# EAGLE design Si5351 (EAGLE 9.3.1)
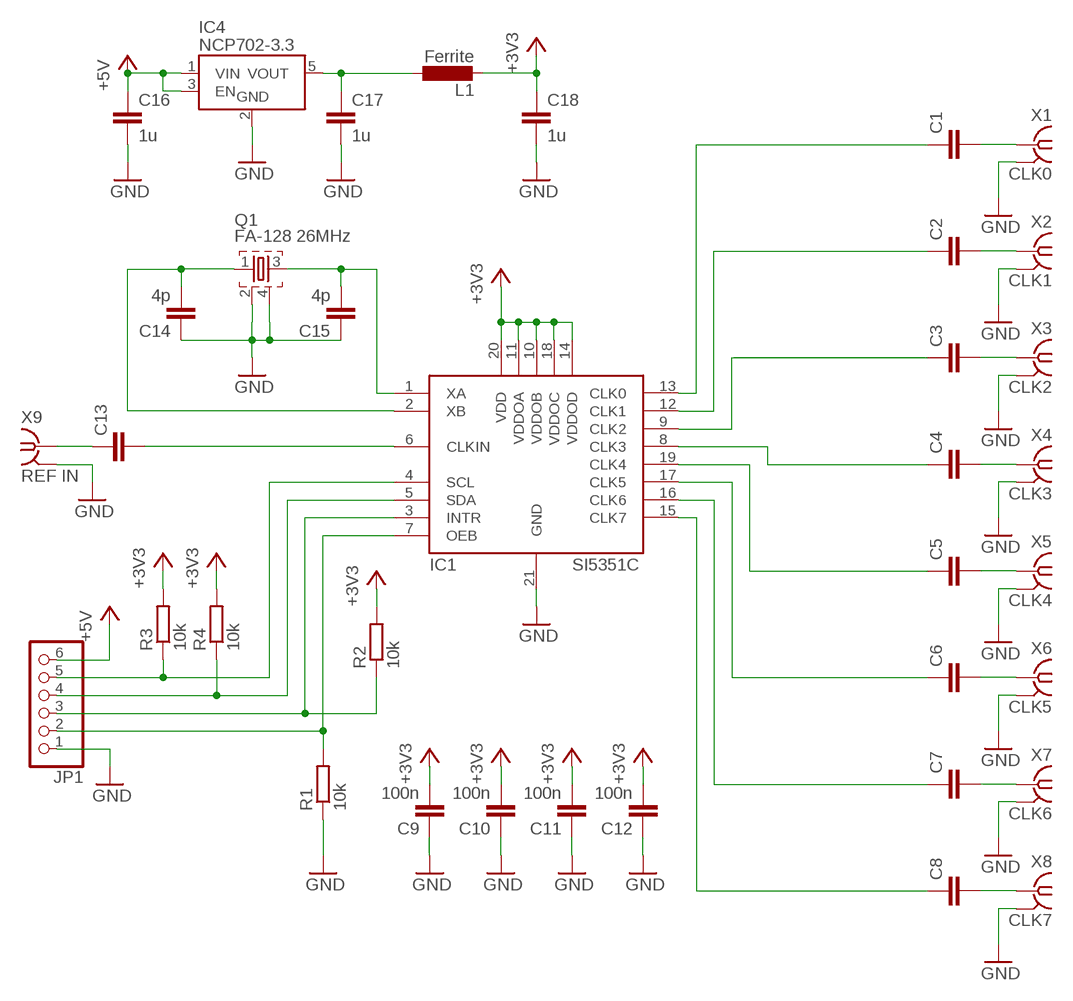
[diagram p0: schematic, sheet 1]

## Parts
C1  C-EUC0603  [C0603]
C2  C-EUC0603  [C0603]
C3  C-EUC0603  [C0603]
C4  C-EUC0603  [C0603]
C5  C-EUC0603  [C0603]
C6  C-EUC0603  [C0603]
C7  C-EUC0603  [C0603]
C8  C-EUC0603  [C0603]
C9  100n  C-EUC0603  [C0603]
C10  100n  C-EUC0603  [C0603]
C11  100n  C-EUC0603  [C0603]
C12  100n  C-EUC0603  [C0603]
C13  C-EUC0603  [C0603]
C14  4p  C-EUC0603  [C0603]
C15  4p  C-EUC0603  [C0603]
C16  1u  C-EUC0603  [C0603]
C17  1u  C-EUC0603  [C0603]
C18  1u  C-EUC0603  [C0603]
IC1  SI5351C  [QFN50P400X400X90-21T270N]
IC4  NCP702-3.3  NCP702  [SOT95P240X110-5]
JP1  PINHD-1X6/90  [1X06/90]
L1  Ferrite  INDUCTOR0603  [R0603]
Q1  FA-128 26MHz  FA-128  [FA-128]
R1  10k  R-EU_R0603  [R0603]
R2  10k  R-EU_R0603  [R0603]
R3  10k  R-EU_R0603  [R0603]
R4  10k  R-EU_R0603  [R0603]
X1  CLK0  SMA_CONNECTOR  [J502-ND-142-0711-821/826]
X2  CLK1  SMA_CONNECTOR  [J502-ND-142-0711-821/826]
X3  CLK2  SMA_CONNECTOR  [J502-ND-142-0711-821/826]
X4  CLK3  SMA_CONNECTOR  [J502-ND-142-0711-821/826]
X5  CLK4  SMA_CONNECTOR  [J502-ND-142-0711-821/826]
X6  CLK5  SMA_CONNECTOR  [J502-ND-142-0711-821/826]
X7  CLK6  SMA_CONNECTOR  [J502-ND-142-0711-821/826]
X8  CLK7  SMA_CONNECTOR  [J502-ND-142-0711-821/826]
X9  REF IN  SMA_CONNECTOR  [J502-ND-142-0711-821/826]

## Nets
+3V3: C9.2 C10.2 C11.2 C12.2 C18.1 IC1.10(VDDOB) IC1.11(VDDOA) IC1.14(VDDOD) IC1.18(VDDOC) IC1.20(VDD) L1.2 R2.2 R3.2 R4.2
+5V: C16.1 IC4.1(VIN) IC4.3(EN) JP1.6
GND: C9.1 C10.1 C11.1 C12.1 C14.1 C15.1 C16.2 C17.2 C18.2 IC1.21(GND) IC4.2(GND) JP1.1 Q1.2 Q1.4 R1.1 X1.G@1 X1.G@2 X1.G@3 X1.G@4 X2.G@1 X2.G@2 X2.G@3 X2.G@4 X3.G@1 X3.G@2 X3.G@3 X3.G@4 X4.G@1 X4.G@2 X4.G@3 X4.G@4 X5.G@1 X5.G@2 X5.G@3 X5.G@4 X6.G@1 X6.G@2 X6.G@3 X6.G@4 X7.G@1 X7.G@2 X7.G@3 X7.G@4 X8.G@1 X8.G@2 X8.G@3 X8.G@4 X9.G@1 X9.G@2 X9.G@3 X9.G@4
N$1: C1.2 X1.1
N$2: C2.2 X2.1
N$3: C3.2 X3.1
N$4: C4.2 X4.1
N$5: C5.2 X5.1
N$6: C6.2 X6.1
N$7: C7.2 X7.1
N$8: C8.2 X8.1
N$9: C1.1 IC1.13(CLK0)
N$10: C2.1 IC1.12(CLK1)
N$11: C3.1 IC1.9(CLK2)
N$12: C8.1 IC1.15(CLK7)
N$13: C7.1 IC1.16(CLK6)
N$14: C6.1 IC1.17(CLK5)
N$15: C5.1 IC1.19(CLK4)
N$16: C4.1 IC1.8(CLK3)
N$17: IC1.4(SCL) JP1.5 R3.1
N$18: C13.1 X9.1
N$19: C13.2 IC1.6(CLKIN)
N$20: IC1.5(SDA) JP1.4 R4.1
N$21: IC1.3(INTR) JP1.3 R2.1
N$22: IC1.7(OEB) JP1.2 R1.2
N$23: C15.2 IC1.1(XA) Q1.3
N$24: C14.2 IC1.2(XB) Q1.1
N$26: C17.1 IC4.5(VOUT) L1.1

## Library data of the parts
C1-C18 = rcl:C-EU: CAPACITOR, European symbol
IC1 = rf:SI5351C
IC4 = rf:NCP702
JP1 = pinhead:PINHD-1X6: PIN HEADER
L1 = rf:INDUCTOR
Q1 = crystal:FA-: MHz RANGE CRYSTAL UNIT Source: Epson Toyocom
R1-R4 = rcl:R-EU_: RESISTOR, European symbol
X1-X9 = rf:SMA_CONNECTOR

## Board
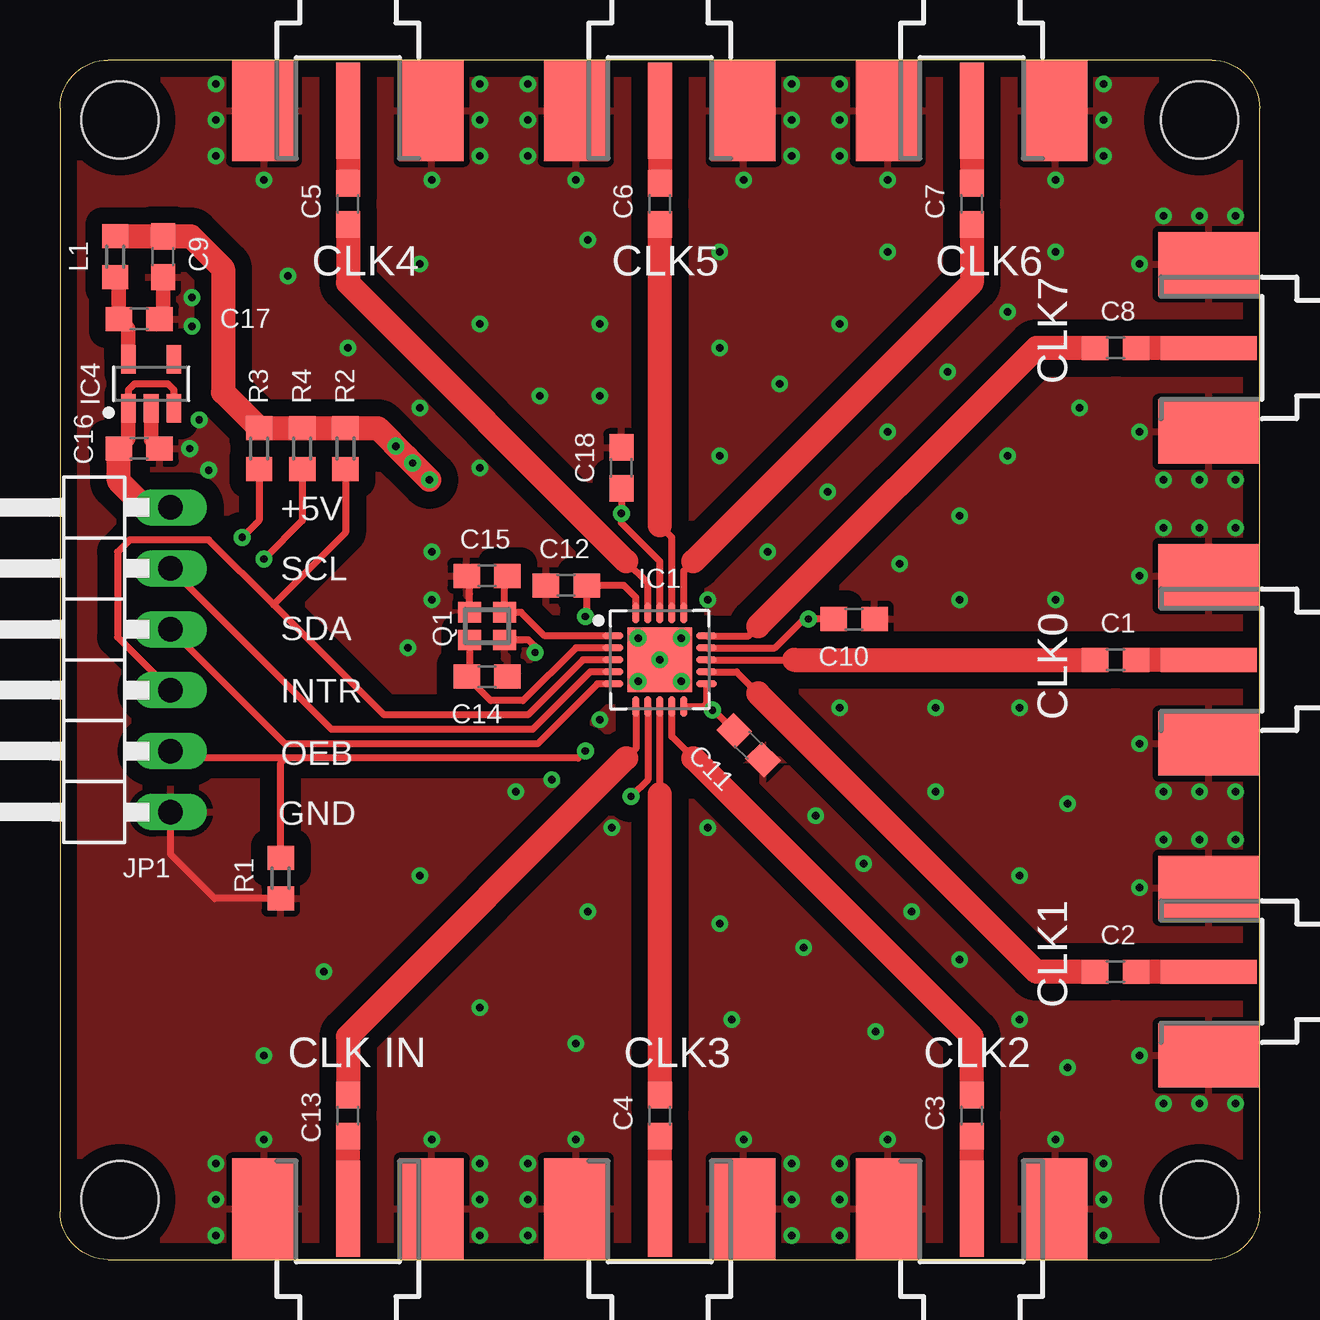
[diagram p1: board, top side]
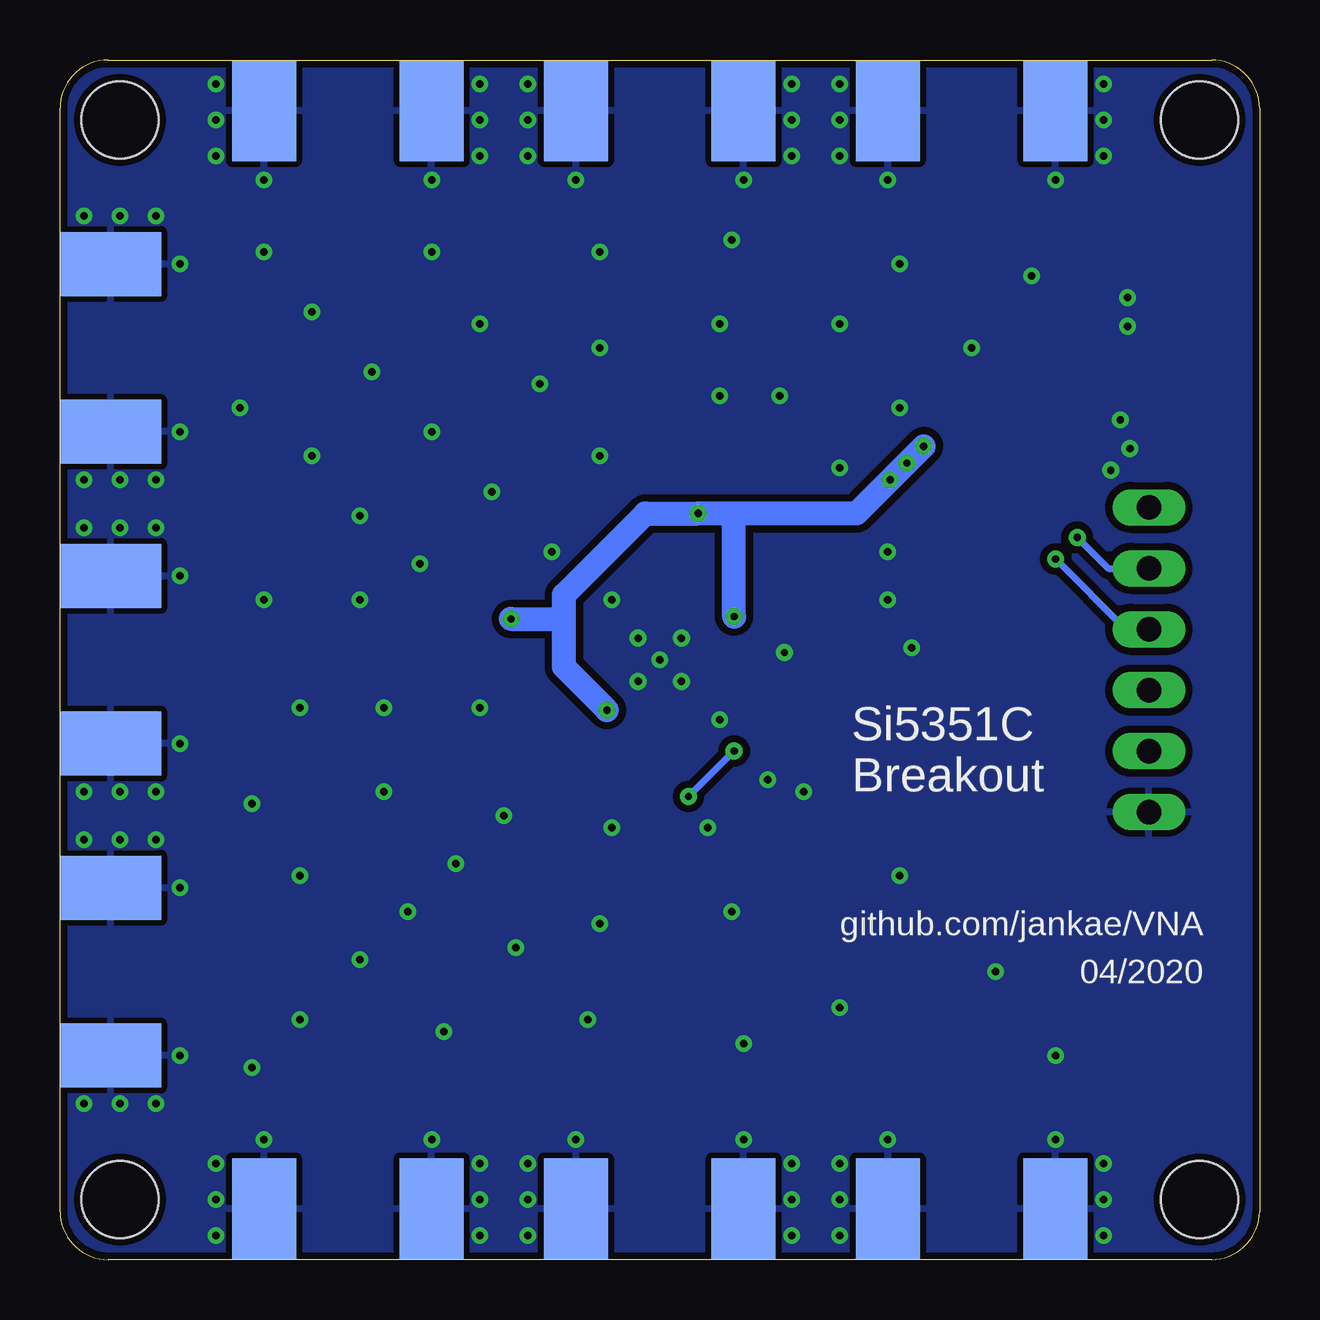
[diagram p2: board, bottom side, seen from below]

Size 50 x 50 mm. Coordinates in mm from the lower left corner, seen from the top.
Outline: 0,48 0,2 arc90 2,0 48,0 arc90 50,2 50,48 arc90 48,50 2,50 arc90 0,48
Copper layers (1*16): Top 0.035mm / dielectric 0.2mm / Bottom 0.035mm
Design rules "JLCPCB4L_7628 *": minimum track width 6mil, minimum drill 0.3mm, track to track 5mil, track to pad 5mil, pad to pad 5mil, via to via 5mil, smd to smd 0mil, copper to edge 0.2mm, drill to drill 0.2mm, minimum pad ring 10mil, minimum via ring 8mil, stop-mask expansion 4mil, vias tented up to drill 0mil, thermal gap 10mil
Holes 3.2 mm at 2.5,47.5 47.5,47.5 47.5,2.5 2.5,2.5

### Footprints (pad centres in the part's own frame; a part is rotated, then mirrored left to right if it is on the bottom)
C0603 = smd 1.1 x 1: 1 -0.85,0; 2 0.85,0
QFN50P400X400X90-21T270N = smd 0.838 x 0.27: 1 -1.946,1; 2 -1.946,0.5; 3 -1.946,0; 4 -1.946,-0.5; 5 -1.946,-1; 11 1.946,-1; 12 1.946,-0.5; 13 1.946,0; 14 1.946,0.5; 15 1.946,1 | smd 0.27 x 0.838: 6 -1,-1.946; 7 -0.5,-1.946; 8 0,-1.946; 9 0.5,-1.946; 10 1,-1.946; 16 1,1.946; 17 0.5,1.946; 18 0,1.946; 19 -0.5,1.946; 20 -1,1.946 | smd 2.7 x 2.7: 21 0,0
SOT95P240X110-5 = smd 1.18 x 0.609: 1 -1.024,0.95; 2 -1.024,0; 3 -1.024,-0.95; 4 1.024,-0.95; 5 1.024,0.95
1X06/90 = drill 1.016 long: 1 -6.35,-3.81; 2 -3.81,-3.81; 3 -1.27,-3.81; 4 1.27,-3.81; 5 3.81,-3.81; 6 6.35,-3.81
R0603 = smd 1 x 1.1: 1 -0.85,0; 2 0.85,0
FA-128 = smd 0.95 x 0.85: 1 -0.725,-0.575; 2 0.725,-0.575; 3 0.725,0.575; 4 -0.725,0.575
J502-ND-142-0711-821/826 = smd 4 x 1: 1 2.115,0 | smd 4.191 x 2.667: G@1 2.115,3.495; G@2 2.115,-3.495 | smd 4.191 x 2.667 bottom: G@3 2.115,3.495; G@4 2.115,-3.495

### Placement (x,y rotation side)
C1  44,25 0 top
C2  44,12 0 top
C3  38,6 270 top
C4  25,6 270 top
C5  12,44 90 top
C6  25,44 90 top
C7  38,44 90 top
C8  44,38 0 top
C9  4.3,41.8 90 top
C10  33.1,26.7 180 top
C11  28.7,21.44 135 top
C12  21.1,28.1 0 top
C13  12,6 90 top
C14  17.8,24.3 180 top
C15  17.8,28.5 0 top
C16  3.3,33.8 0 top
C17  3.3,39.2 0 top
C18  23.4,33 90 top
IC1  25,25 0 top
IC4  3.8,36.5 90 top
JP1  0.8,25 90 top
L1  2.3,41.8 90 top
Q1  17.8,26.4 0 top
R1  9.2,15.9 90 top
R2  11.9,33.8 90 top
R3  8.3,33.8 90 top
R4  10.1,33.8 90 top
X1  50,25 180 top
X2  50,12 180 top
X3  38,0 90 top
X4  25,0 90 top
X5  12,50 270 top
X6  25,50 270 top
X7  38,50 270 top
X8  50,38 180 top
X9  12,0 90 top

### Tracks (layer width: path | path; a pad name or v marks a point on that pad's centre or on a via)
+3V3  (via drill 0.3)
  Top 0.3: IC1.14 29.8,25.5 31,26.7 v31.2,26.7 C10.2 | C11.2 27.24,22.9 | 27.24,22.9 v27.2,22.9 | IC1.11 26.95,23.2 27.24,22.9 | IC1.10 27.09,23.05 27.24,22.9 | IC1.18 25,29.1 23.4,30.7 v23.4,31.1 C18.1 | IC1.20 24,27.6 23.5,28.1 C12.2 21.95,26.85 v21.9,26.8 | v14,33.9 14.45,33.9 14.45,33.45 14.45,33.2 v14.7,33.2
  Top 1: L1.2 C9.2 5.45,42.65 6.8,41.3 6.8,36.15 R3.2 R4.2 R2.2 13.25,34.65 14.45,33.45 v15.4,32.5
  Bottom 1: v27.2,22.9 29,24.7 29,26.7 | 29,26.7 29,27.7 25.6,31.1 v23.4,31.1 21.9,31.1 | v31.2,26.7 29,26.7 | v14,33.9 16.8,31.1 21.9,31.1 | v21.9,26.8 21.9,31.1
+5V
  Top 0.3: IC4.3 4.75,36.25 4.5,36.5 3.1,36.5 2.85,36.25 IC4.1
  Top 0.6: IC4.1 2.85,34.2 C16.1
  Top 1: JP1.6 3.55,31.35 2.45,32.45 C16.1
GND  (via drill 0.3)
  Top 0.3: Q1.4 17.07,28.38 C15.1 | R1.1 6.45,15.05 4.61,16.89 JP1.1 | v19.8,25.3 19.8,25.57 19.77,25.57 19.52,25.82 Q1.2
  Top 0.6: IC4.2 3.8,34.15 C16.2 | C9.1 4.3,39.35 C17.2
  other vias: 24.1,25.9 25.9,25.9 25.9,24.1 24.1,24.1 25,25 5.4,33.8 5.8,35 6.2,32.9 5.5,38.9 5.5,40.1 8.5,45 6.5,49 6.5,47.5 6.5,46 15.5,45 17.5,49 17.5,47.5 17.5,46 19.5,46 19.5,47.5 19.5,49 21.5,45 28.5,45 30.5,49 30.5,47.5 30.5,46 32.5,46 32.5,47.5 32.5,49 34.5,45 43.5,49 43.5,47.5 43.5,46 41.5,45 49,43.5 47.5,43.5 46,43.5 45,41.5 45,34.5 46,32.5 47.5,32.5 49,32.5 49,30.5 47.5,30.5 46,30.5 45,28.5 45,21.5 46,19.5 47.5,19.5 49,19.5 49,17.5 47.5,17.5 46,17.5 45,15.5 49,6.5 47.5,6.5 46,6.5 45,8.5 41.5,5 43.5,1 43.5,2.5 43.5,4 32.5,1 32.5,2.5 32.5,4 34.5,5 30.5,1 30.5,2.5 30.5,4 28.5,5 19.5,1 19.5,2.5 19.5,4 21.5,5 17.5,1 17.5,2.5 17.5,4 15.5,5 6.5,1 6.5,2.5 6.5,4 8.5,5 21.5,9 22,14.5 17.5,10.5 19,19.5 15,16 11,12 8.5,8.5 22.5,22.5 20.5,20 23,18 27,18 27.5,14 28,10 34,9.5 31,13 31.5,18.5 33.5,16.5 35.5,14.5 37.5,12.5 40,10 42,8 32.5,23 36.5,23 40,23 36.5,19.5 40,16 42,19 42.5,35.5 39.5,33.5 37.5,31 35,29 37.5,27.5 41.5,27.5 27,27.5 29.5,29.5 32,32 34.5,34.5 37,37 39.5,39.5 41.5,42 34.5,42 32.5,39 30,36.5 27.5,33.5 27.5,38 27.5,42 22,42.5 22.5,39 22.5,36 20,36 17.5,39 15,41.5 17.5,33 15,35.5 12,38 9.5,41 15.5,29.5 15.5,27.5 14.5,25.5
  pour Top (isolate 0.7): -2,52.5 54,52.5 54,-3 -2,-3
  pour Bottom (isolate 0.3): -1.5,51 52,51 52,-1.5 -1.5,-1.5
N$1
  Top 1: X1.1 C1.2
N$2
  Top 1: X2.1 C2.2
N$3
  Top 1: X3.1 C3.2
N$4
  Top 1: X4.1 C4.2
N$5
  Top 1: X5.1 C5.2
N$6
  Top 1: X6.1 C6.2
N$7
  Top 1: X7.1 C7.2
N$8
  Top 1: X8.1 C8.2
N$9
  Top 0.3: IC1.13 30.6,25
  Top 1: 30.6,25 C1.1
N$10
  Top 0.3: IC1.12 28.2,24.5 29.1,23.6
  Top 1: C2.1 40.7,12 29.1,23.6
N$11
  Top 0.3: 26.4,20.9 25.5,21.8 IC1.9
  Top 1: C3.1 38,9.3 26.4,20.9
N$12
  Top 0.3: IC1.15 28.7,26 29.1,26.4
  Top 1: C8.1 40.7,38 29.1,26.4
N$13
  Top 0.3: IC1.16 26,28.7 26.4,29.1
  Top 1: C7.1 38,40.7 26.4,29.1
N$14
  Top 0.3: IC1.17 25.5,30.1 25,30.6
  Top 1: 25,30.6 C6.1
N$15
  Top 0.3: IC1.19 24.5,28.2 23.6,29.1
  Top 1: C5.1 12,40.7 23.6,29.1
N$16
  Top 0.3: 25,19.4 IC1.8
  Top 1: C4.1 25,19.4
N$17  (via drill 0.3)
  Top 0.3: IC1.4 22.1,24.5 19.7,22.1 11.32,22.1 JP1.5 | R3.1 8.3,30.8 v7.6,30.1
  Bottom 0.3: v7.6,30.1 6.31,28.81 JP1.5
N$18
  Top 1: X9.1 C13.1
N$19
  Top 0.3: IC1.6 24,21.3 23.6,20.9
  Top 1: 23.6,20.9 12,9.3 C13.2
N$20  (via drill 0.3)
  Top 0.3: IC1.5 22.4,24 19.9,21.5 9.38,21.5 JP1.4 | R4.1 10.1,30.8 v8.5,29.2
  Bottom 0.3: v8.5,29.2 5.57,26.27 JP1.4
N$21
  Top 0.3: IC1.3 21.8,25 19.5,22.7 13.5,22.7 8.9,27.3 | 8.9,27.3 6.2,30 2.9,30 2.4,29.5 2.4,25.94 JP1.3 | R2.1 11.9,30.3 8.9,27.3
N$22  (via drill 0.3)
  Top 0.3: IC1.7 24.5,20 v23.8,19.3 | 9.4,20.9 21.6,20.9 v21.9,21.2 | 9.4,20.9 4.9,20.9 JP1.2 | R1.2 9.2,20.7 9.4,20.9
  Bottom 0.3: v23.8,19.3 v21.9,21.2
N$23
  Top 0.3: IC1.1 20.2,26 19.23,26.98 Q1.3 18.52,28.38 C15.2
N$24
  Top 0.3: IC1.2 21.5,25.5 19.3,23.3 17.95,23.3 C14.2 17.07,24.43 Q1.1
N$26
  Top 0.6: IC4.5 2.85,38.8 C17.1 2.45,40.8 L1.1

### Text on the board
tPlace: CLK4 | CLK5 | CLK6 | CLK7 | +5V | SCL | SDA | INTR | CLK0 | OEB | GND | CLK1 | CLK IN | CLK3 | CLK2
bPlace: Si5351C / Breakout | github.com/jankae/VNA | 04/2020